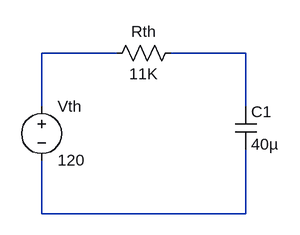
[diagram p0: schematic EJ1_eq.asc]
EJ1_eq.asc, the LTspice schematic file:
Version 4.1
SHEET 1 880 680
WIRE 48 80 -64 80
WIRE 240 80 128 80
WIRE -64 160 -64 80
WIRE 240 160 240 80
WIRE -64 320 -64 240
WIRE 240 320 240 224
WIRE 240 320 -64 320
SYMBOL res 144 64 R90
WINDOW 0 0 56 VBottom 2
WINDOW 3 32 56 VTop 2
SYMATTR InstName Rth
SYMATTR Value 11K
SYMBOL cap 224 160 R0
SYMATTR InstName C1
SYMATTR Value 40µ
SYMBOL voltage -64 144 R0
SYMATTR InstName Vth
SYMATTR Value 120

The netlist it stands for:
* EJ1_eq.asc
Rth N002 N001 11K
C1 N002 N003 40µ
Vth N001 N003 120
.backanno
.end